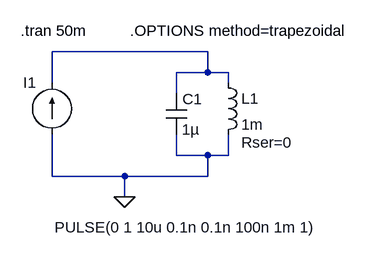
[diagram p0: schematic Fig_5-4_Check-Trapezoidal.asc]
Fig_5-4_Check-Trapezoidal.asc, the LTspice schematic file:
Version 4
SHEET 1 880 680
WIRE 320 96 80 96
WIRE 320 128 320 96
WIRE 320 128 272 128
WIRE 352 128 320 128
WIRE 80 144 80 96
WIRE 352 144 352 128
WIRE 272 160 272 128
WIRE 272 256 272 224
WIRE 320 256 272 256
WIRE 352 256 352 224
WIRE 352 256 320 256
WIRE 80 288 80 224
WIRE 192 288 80 288
WIRE 320 288 320 256
WIRE 320 288 192 288
WIRE 192 320 192 288
FLAG 192 320 0
SYMBOL current 80 224 R180
WINDOW 0 24 80 Left 2
WINDOW 3 -409 -143 Left 2
WINDOW 123 0 0 Left 2
WINDOW 39 0 0 Left 2
SYMATTR InstName I1
SYMATTR Value PULSE(0 1 10u 0.1n 0.1n 100n 1m 1)
SYMBOL ind 336 128 R0
WINDOW 39 36 108 Left 2
SYMATTR SpiceLine Rser=0
SYMATTR InstName L1
SYMATTR Value 1m
SYMBOL cap 256 160 R0
WINDOW 0 25 9 Left 2
SYMATTR InstName C1
SYMATTR Value 1µ
TEXT 32 64 Left 2 !.tran 50m
TEXT 200 64 Left 2 !.OPTIONS method=trapezoidal

The netlist it stands for:
* Fig_5-4_Check-Trapezoidal.asc
I1 0 N001 PULSE(0 1 10u 0.1n 0.1n 100n 1m 1)
L1 N001 0 1m Rser=0
C1 N001 0 1µ
.tran 50m
.OPTIONS method=trapezoidal
.backanno
.end